# Altium schematic sheet Temperature Interface.SchDoc
size A4
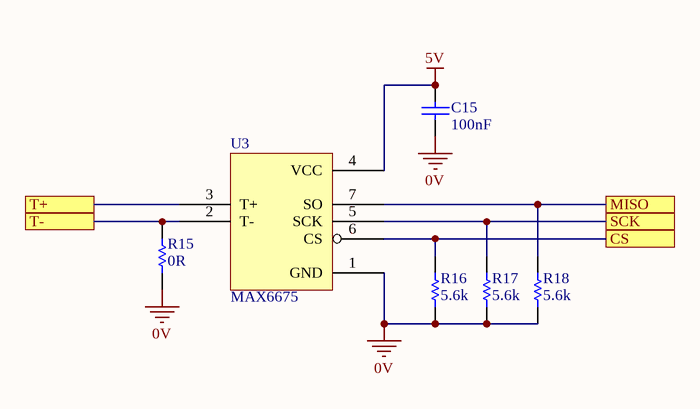
[diagram p0: Temperature Interface.SchDoc]

## Parts
C15  100nF  [0805]
R15  0R  [0805]
R16  5.6k  [0805]
R17  5.6k  [0805]
R18  5.6k  [0805]
U3  MAX6675  [MI 8-SOIC]

## Ports
CS, MISO, SCK, T+, T-

## Nets
0V: C15.1 R15.1 R16.1 R17.1 R18.1 U3.1(GND)
5V: C15.2 U3.4(VCC)
CS: R16.2 U3.6(CS) ; port CS
MISO: R18.2 U3.7(SO) ; port MISO
SCK: R17.2 U3.5(SCK) ; port SCK
T+: U3.3(T+) ; port T+
T-: R15.2 U3.2(T-) ; port T-

## Library data of the parts
C15 = GCM21BR71H104KA37L: Manufacturer: muRata; Tolerance: ±10%; Material: X7R; Rated Voltage: 50V; Part Number: GCM21BR71H104KA37L; Value: 100nF; Digikey Part Number: 490-6064-1-ND
R15 = RC0805FR070RL: Manufacturer: YAGEO; Tolerance: 0.01; Rated Voltage: 0.125W; Part Number: RC0805FR070RL; Value: 0R; Material: FR-07; Digikey Part Number: 311-0.0CRCT-ND
R16-R18 = RC0805FR075K6L: Manufacturer: YAGEO; Tolerance: 0.01; Rated Voltage: 0.125W; Part Number: RC0805FR075K6L; Value: 5.6k; Material: FR-07; Digikey Part Number: 311-5.60KCRCT-ND
U3 = MAX6675: IC THERMOCOUP TO DGTL 8-SOIC; Manufacturer: Maxim Integrated; Part Number: MAX6675; Digikey Part Number: MAX6675ISA+-ND; Digikey Link: https://www.digikey.com/product-detail/en/maxim-integrated/MAX6675ISA/MAX6675ISA-ND/1513517